# EAGLE design Adafruit DC+Stepper Wing (EAGLE 6.4)
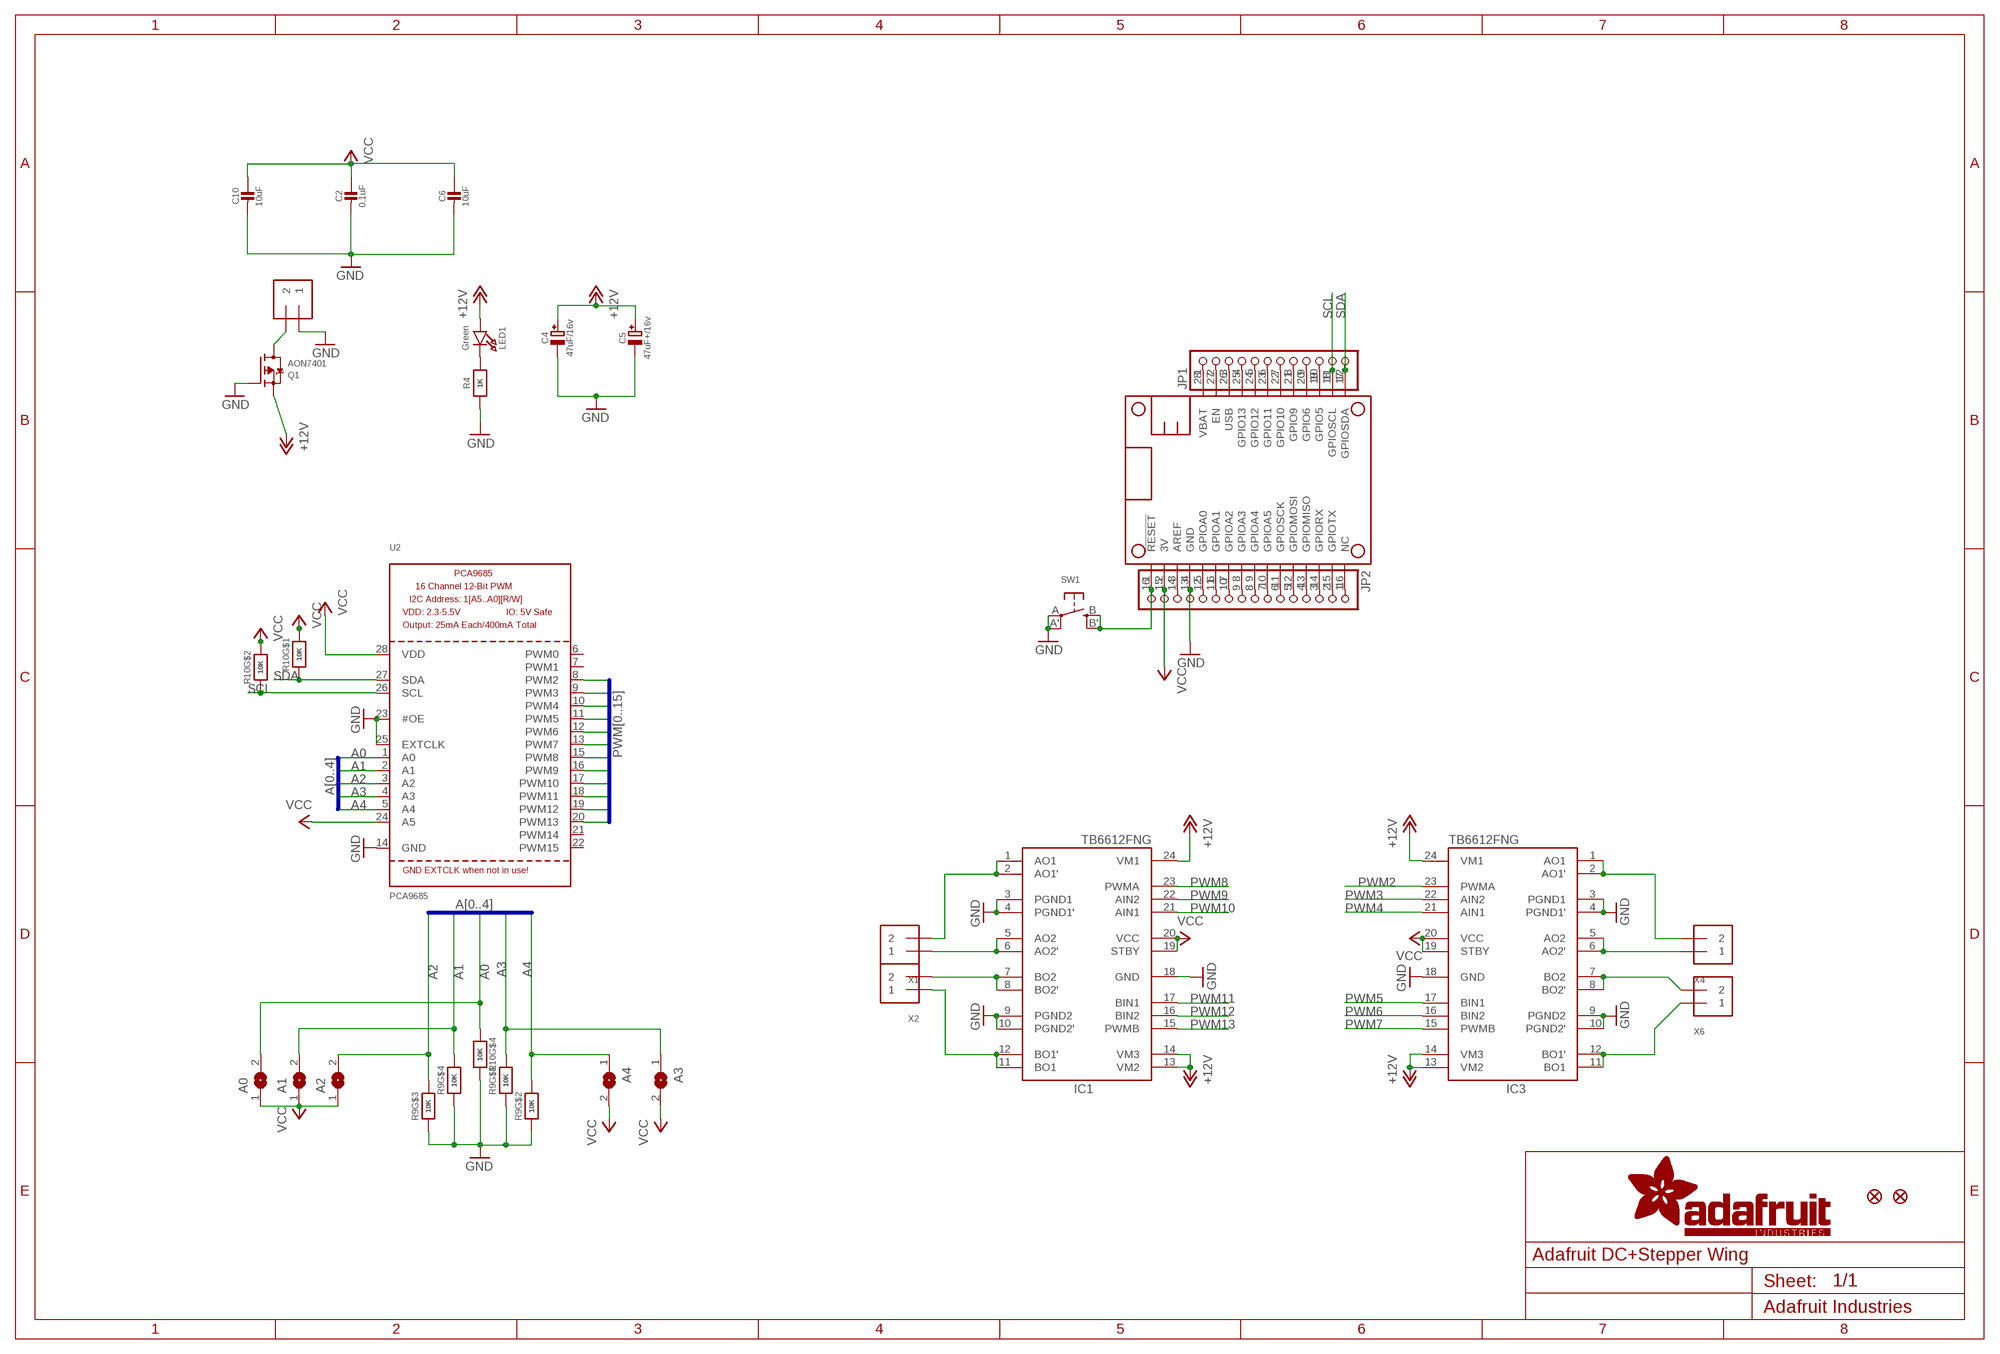
[diagram p0: schematic, sheet 1]

## Parts
A0  SOLDERJUMPERREFLOW_NOPASTE  [SOLDERJUMPER_REFLOW_NOPASTE]
A1  SOLDERJUMPERREFLOW_NOPASTE  [SOLDERJUMPER_REFLOW_NOPASTE]
A2  SOLDERJUMPERREFLOW_NOPASTE  [SOLDERJUMPER_REFLOW_NOPASTE]
A3  SOLDERJUMPERREFLOW_NOPASTE  [SOLDERJUMPER_REFLOW_NOPASTE]
A4  SOLDERJUMPERREFLOW_NOPASTE  [SOLDERJUMPER_REFLOW_NOPASTE]
C2  0.1uF  CAP_CERAMIC0805-NOOUTLINE  [0805-NO]
C4  47uF/16v  CAP_ELECTROLYTICPANASONIC_C  [PANASONIC_C]
C5  47uF+/16v  CAP_ELECTROLYTICPANASONIC_C  [PANASONIC_C]
C6  10uF  CAP_CERAMIC0805-NOOUTLINE  [0805-NO]
C10  10uF  CAP_CERAMIC0805-NOOUTLINE  [0805-NO]
IC1  TB6612FNG  [SSOP24]
IC3  TB6612FNG  [SSOP24]
JP1  HEADER-1X12  [1X12_ROUND]
JP2  HEADER-1X16ROUND  [1X16_ROUND]
LED1  Green  LED0805_NOOUTLINE  [CHIPLED_0805_NOOUTLINE]
MPOWER  1X2-3.5MM  [1X2-3.5MM]
MS1  FEATHERWING  [FEATHERWING]
Q1  AON7401  MOSFET-P-POWERDI3333  [POWERDI3333]
R4  1K  RESISTOR0805_NOOUTLINE  [0805-NO]
R9  10K  RESISTOR_4PACK  [RESPACK_4X0603]
R10  10K  RESISTOR_4PACK  [RESPACK_4X0603]
SW1  SWITCH_TACT_SMT4.6X2.8  [BTN_KMR2_4.6X2.8]
U2  PCA9685  [TSSOP28]
U$3  FIDUCIAL""  [FIDUCIAL_1MM]
U$4  FIDUCIAL""  [FIDUCIAL_1MM]
X1  TERMBLOCK_1X2  [TERMBLOCK_1X2-3.5MM]
X2  TERMBLOCK_1X2  [TERMBLOCK_1X2-3.5MM]
X4  TERMBLOCK_1X2  [TERMBLOCK_1X2-3.5MM]
X6  TERMBLOCK_1X2  [TERMBLOCK_1X2-3.5MM]

## Nets
+12V: C4.+ C5.+ IC1.13(VM2) IC1.14(VM3) IC1.24(VM1) IC3.13(VM2) IC3.14(VM3) IC3.24(VM1) LED1.A Q1.1(S) Q1.2(S) Q1.3(S)
A0: A0.2 R10.4 U2.1(A0)
A1: A1.2 R9.5 U2.2(A1)
A2: A2.2 R9.6 U2.3(A2)
A3: A3.1 R9.8 U2.4(A3)
A4: A4.1 R9.7 U2.5(A4)
GND: C2.2 C4.- C5.- C6.2 C10.2 IC1.3(PGND1) IC1.4(PGND1') IC1.9(PGND2) IC1.10(PGND2') IC1.18(GND) IC3.3(PGND1) IC3.4(PGND1') IC3.9(PGND2) IC3.10(PGND2') IC3.18(GND) JP2.13 MPOWER.1 MS1.4(GND) Q1.4(G) R4.1 R9.1 R9.2 R9.3 R9.4 R10.5 SW1.A'(P1) SW1.A(P) U2.14(GND) U2.23(#OE) U2.25(EXTCLK)
N$1: JP1.2 MS1.27(EN)
N$2: JP1.4 MS1.25(GPIO13)
N$3: MPOWER.2 Q1.5678(D)
N$4: IC1.1(AO1) IC1.2(AO1') X1.2
N$5: JP1.5 MS1.24(GPIO12)
N$6: IC1.5(AO2) IC1.6(AO2') X1.1
N$7: IC1.7(BO2) IC1.8(BO2') X2.2
N$8: JP1.6 MS1.23(GPIO11)
N$9: IC1.11(BO1) IC1.12(BO1') X2.1
N$10: JP1.7 MS1.22(GPIO10)
N$11: JP1.8 MS1.21(GPIO9)
N$12: IC3.1(AO1) IC3.2(AO1') X4.2
N$13: JP1.9 MS1.20(GPIO6)
N$14: IC3.5(AO2) IC3.6(AO2') X4.1
N$15: IC3.7(BO2) IC3.8(BO2') X6.2
N$16: JP1.10 MS1.19(GPIO5)
N$17: IC3.11(BO1) IC3.12(BO1') X6.1
N$18: JP2.1 MS1.16(NC)
N$19: JP2.2 MS1.15(GPIOTX)
N$20: JP2.3 MS1.14(GPIORX)
N$21: JP2.4 MS1.13(GPIOMISO)
N$22: JP2.5 MS1.12(GPIOMOSI)
N$23: JP2.6 MS1.11(GPIOSCK)
N$24: JP2.7 MS1.10(GPIOA5)
N$25: JP2.8 MS1.9(GPIOA4)
N$26: JP2.9 MS1.8(GPIOA3)
N$27: JP2.10 MS1.7(GPIOA2)
N$28: JP2.11 MS1.6(GPIOA1)
N$29: JP2.12 MS1.5(GPIOA0)
N$30: JP2.14 MS1.3(AREF)
N$32: JP2.16 MS1.1(!RESET) SW1.B'(S1) SW1.B(S)
N$133: LED1.C R4.2
PWM2: IC3.23(PWMA) U2.8(PWM2)
PWM3: IC3.22(AIN2) U2.9(PWM3)
PWM4: IC3.21(AIN1) U2.10(PWM4)
PWM5: IC3.17(BIN1) U2.11(PWM5)
PWM6: IC3.16(BIN2) U2.12(PWM6)
PWM7: IC3.15(PWMB) U2.13(PWM7)
PWM8: IC1.23(PWMA) U2.15(PWM8)
PWM9: IC1.22(AIN2) U2.16(PWM9)
PWM10: IC1.21(AIN1) U2.17(PWM10)
PWM11: IC1.17(BIN1) U2.18(PWM11)
PWM12: IC1.16(BIN2) U2.19(PWM12)
PWM13: IC1.15(PWMB) U2.20(PWM13)
SCL: JP1.11 MS1.18(GPIOSCL) R10.2 U2.26(SCL)
SDA: JP1.12 MS1.17(GPIOSDA) R10.1 U2.27(SDA)
USB: JP1.3 MS1.26(USB)
VBAT: JP1.1 MS1.28(VBAT)
VCC: A0.1 A1.1 A2.1 A3.2 A4.2 C2.1 C6.1 C10.1 IC1.19(STBY) IC1.20(VCC) IC3.19(STBY) IC3.20(VCC) JP2.15 MS1.2(3V) R10.7 R10.8 U2.24(A5) U2.28(VDD)
Unconnected: R10.3 R10.6 U2.6(PWM0) U2.7(PWM1) U2.21(PWM14) U2.22(PWM15)

## Buses
PWM[0..15]
A[0..4]

## Library data of the parts
A0 A1-A4 = microbuilder:SOLDERJUMPER: SMD Solder JUMPER Solder the two pads together to create a connection, or remove the solder to break it. REFLOW - Use this footprint for solder paste and reflow ovens. WAVE - Use this footprint for hand-soldering (larger pads). CLOSED - Has a trace between the two pads to ensure it is closed by default. The trace needs to be cut to disable the jumper, and can be closed again by creating a solder bridge between the two pads.
C2 C6 C10 = microbuilder:CAP_CERAMIC: Ceramic Capacitors For new designs, use the packages preceded by an '_' character since they are more reliable: The following footprints should be used on most boards: _0402 - Standard footprint for regular board layouts _0603 - Standard footprint for regular board layouts _0805 - Standard footprint for regular board layouts _1206 - Standard footprint for regular board layouts For extremely tight-pitch boards where space is at a premium, the following 'micro-pitch' footprints can be used (smaller pads, no silkscreen outline, etc.): _0402MP - Micro-pitch footprint for very dense/compact boards _0603MP - Micro-pitch footprint for very dense/compact boards _0805MP - Micro-pitch footprint for very dense/compact boards _1206MP - Micro-pitch footprint for very dense/compact boards
C4 C5 = microbuilder:CAP_ELECTROLYTIC: Electrolytic Capacitors SMT PANASONIC_C - Size C Panasonic Electrolytic Aluminum Capacitor 47µF 16V 20% Electrolytic Capacitor [Digikey: PCE3890TR-ND] PANASONIC_D - Size D Panasonic Electrolytic Aluminum Capacitor 100µF 25V 20% Electrolytic Capacitor [Digikey: PCE3898TR-ND] PTH 3.5 mm grid, 8 mm diameter ... 3.5 mm grid, 10 mm diameter ...
IC1 IC3 = adafruit:TB6612FNG: TB6612FNG MOS dual H-bridge motor driver, 1.2A current 3.2A peak 3 or 5v logic and 3-15v motor
JP1 = microbuilder:HEADER-1X12
JP2 = microbuilder:HEADER-1X16: PIN HEADER
LED1 = microbuilder:LED: LED 0603 - 0603 Surface Mount Package 2mA: Green LED - Low Power (3.9mcd, 2ma, 1.7Vf) - Digikey: 475-2709-2-ND Orange LED - Low Power (9.8mcd, 2ma, 1.8Vf) - Digikey: 475-1194-2-ND Red LED - Low Power (5mcd, 2ma, 1.8Vf) - Digikey: 475-1195-2-ND Yellow LED - Low Power (7mcd, 2ma, 1.8Vf) - Digikey: 475-1196-2-ND 5mA: Blue LED - Low Power (17mcd, 5ma, 2.9Vf) - Digikey: LNJ937W8CRACT-ND 0805 - 0805 Surface Mount Package 2mA: Red LED (8.8mcd, 2mA, 1.8Vf, Clear) - Low Power [Digikey: 475-2510-1-ND] Green LED (5mcd, 2mA, 1.8Vf, Clear) - Low Power [Digikey: 475-2730-1-ND] Yellow LED (11.3mcd, 2mA, 1.8Vf, Clear) - Low Power [Digikey: 475-2555-1-ND] 20mA: Red LED (104mcd, 20mA, Diffused) - LS R976 [Digikey: 475-1278-6-ND] Red LED (12mcd, 20mA, 2.0Vf, Clear) - APT2012EC [Digikey: 754-1128-1-ND] Green LED (15mcd, 20mA, 2.2Vf, Clear) - APT2012GC [Digikey: 754-1131-1-ND] Orange LED (160mcd, 20mA, 2.1Vf, Clear) - APT2012SECK [Digikey: 754-1130-1-ND] 1206 - 1206 Surface Mount Package Green LED (26mcd, 20mA, Diffused) - LG N971 [Digikey: 475-1407-6-ND] Red LED (15mcd, 20mA, Diffused) - LH N974 [Digikey: 475-1416-6-ND] Cree - Cree High-Power Surface Mount LEDs XPEBWT-L1-0000-00D50 - White 111lm 350mA 2.9Vf 6200K 110° XTEAWT-00-0000-00000LEE3 - White 114lm 350mA 2.85Vf 5000K 115° Everlight - Everlight 45-21 Series Surface Mount LEDs 45-21/QK2C-B2832AC2CB2/2T - Warm White 2000mcd 20mA 3.25Vf 3050K 120° 45-21/LK2C-B38452C4CB2/2T - Nuetral White 2000mcd 20mA 3.25Vf 4150K 120° 45-21/LK2C-B50634C6CB2/2T - Cold White 2200mcd 20mA 3.25Vf 5650K 120° PLCC2 Reverse Mount LS T77K-J1L2-1-0-2-R18-Z - Red 11.25mcd 2mA 1.8Vf 630nm 120° LO T77K-L1M2-24-Z - Orange 19.6mcd 2mA 1.8Vf 606nm 120° LY T77K-K2M1-26-Z - Yellow 15.7mcd 2mA 1.8Vf 587nm 120°
MPOWER = adafruit:1X2: 3.5mm Terminal block http://www.ladyada.net/library/pcb/eaglelibrary.html
MS1 = microbuilder:FEATHERWING
Q1 = microbuilder:MOSFET-P: P-Channel Mosfet LEGEND VDS: Voltage Drain-Source ID: Drain Current RDS(ON): Drain-Source On-State Resistance VGS(TH): Gate-Source Threshold Voltage CISS: Drain-Source Input Capacitance SOT-23 Name VDS ID RDS(ON) VGS(TH) CISS Order Number IRLML5103 30V 760mA 600 mOhm -- 75pF @ 25V Digikey: IRLML5103PBFCT-ND IRLML6401 12V 4.3A 50 mOhm 950mV @ 250µA 830pF @ 10V Digikey: IRLML6401PBFTR-ND NTR0202PL 20V 400mA 800 mOhm 2.3V @ 250uA 70pF @ 5V Digikey: NTR0202PLT1GOSTR-ND NTR4101PT1G 20V 1.8A 85 mOhm 1.2V @ 250uA 675pF @ 10V Digikey: NTR4101PT1GOSCT-ND DMP2004K 20V 600mA 900 mOhm 1V @ 250uA 175pF @ 16V Digikey: DMP2004KDICT-ND PMV65XP 20V 3.9A 76 mOhm 950mV @ 1mA 725pF @ 20V Digikey: 568-2358-2-ND TO-252 Name VDS ID RDS(ON) VGS(TH) CISS Order Number AOD417 30V 25A 34 mOhm 3V @ 250µA 920pF @ 15V Digikey: 785-1106-2-ND
R4 = microbuilder:RESISTOR: Resistors For new designs, use the packages preceded by an '_' character since they are more reliable: The following footprints should be used on most boards: _0402 - Standard footprint for regular board layouts _0603 - Standard footprint for regular board layouts _0805 - Standard footprint for regular board layouts _1206 - Standard footprint for regular board layouts For extremely tight-pitch boards where space is at a premium, the following 'micro-pitch' footprints can be used (smaller pads, no silkscreen outline, etc.): _0402MP - Micro-pitch footprint for very dense/compact boards _0603MP - Micro-pitch footprint for very dense/compact boards _0805MP - Micro-pitch footprint for very dense/compact boards _1206MP - Micro-pitch footprint for very dense/compact boards
R9 R10 = microbuilder:RESISTOR_4PACK: Resistor Packs (4 resistors) 4 x 0603 10K 1/16W - Digikey: YC164J-10KCT-ND
SW1 = microbuilder:SWITCH_TACT_SMT: SMT Tact Switches 6x6mm - Digikey: P12940SCT-ND KMR2 (4.6x2.8mm) - Digikey: 401-1426-1-ND EVQ-PQHB55 - Light Touch, 160GF (4.5x4.5mm) - Digikey: P8090SCT-ND KMT0 - KMT021 NGJ LHS (etc.) IP68/Waterproof - Digikey: CKN10289CT-ND
U2 = microbuilder:PCA9685: PCA9685 - 16 Channel 12-Bit I2C PWM Controller 5.0V tolerant 16 channel, 12-bit I2C PWM controller with 25mA per output (max. 400mA total) Digikey: 568-5931-1-ND
U$3 U$4 = microbuilder:FIDUCIAL: Fiducial Alignment Points Various fiducial points for machine vision alignment.; BOM: EXCLUDE
X1 X2 X4 X6 = microbuilder:TERMBLOCK_1X2: 3.5mm Terminal block http://www.ladyada.net/library/pcb/eaglelibrary.html

## Board
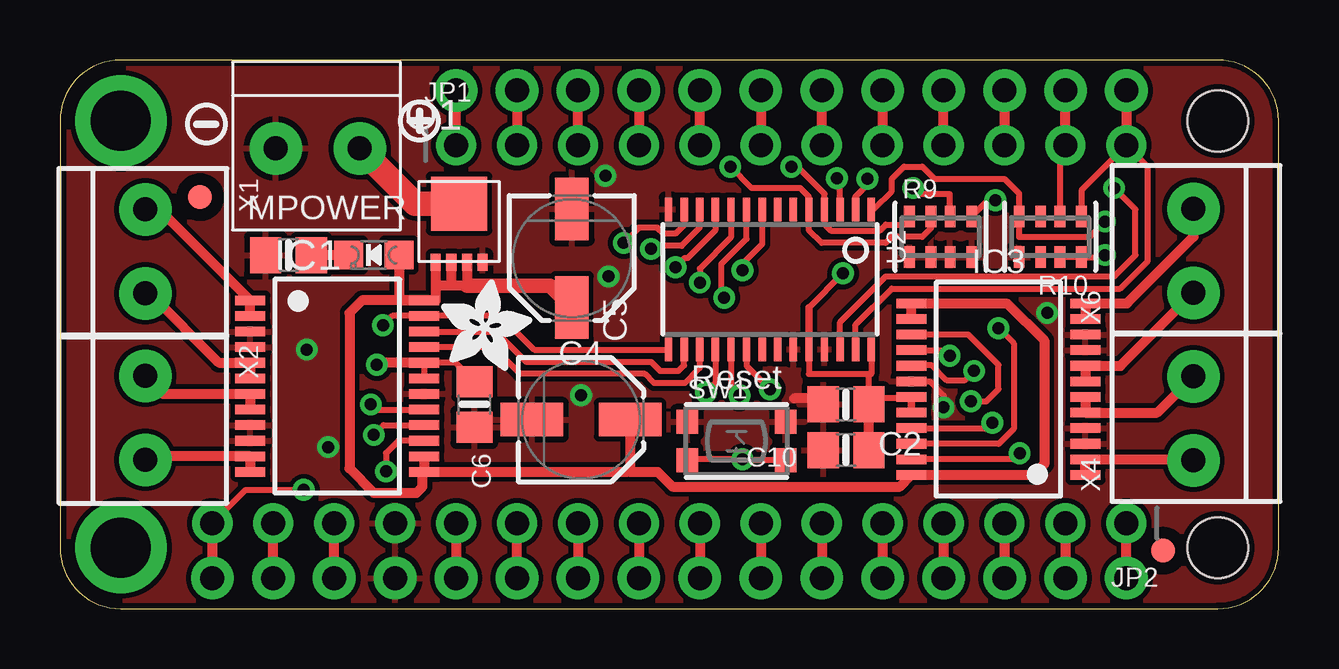
[diagram p1: board, top side]
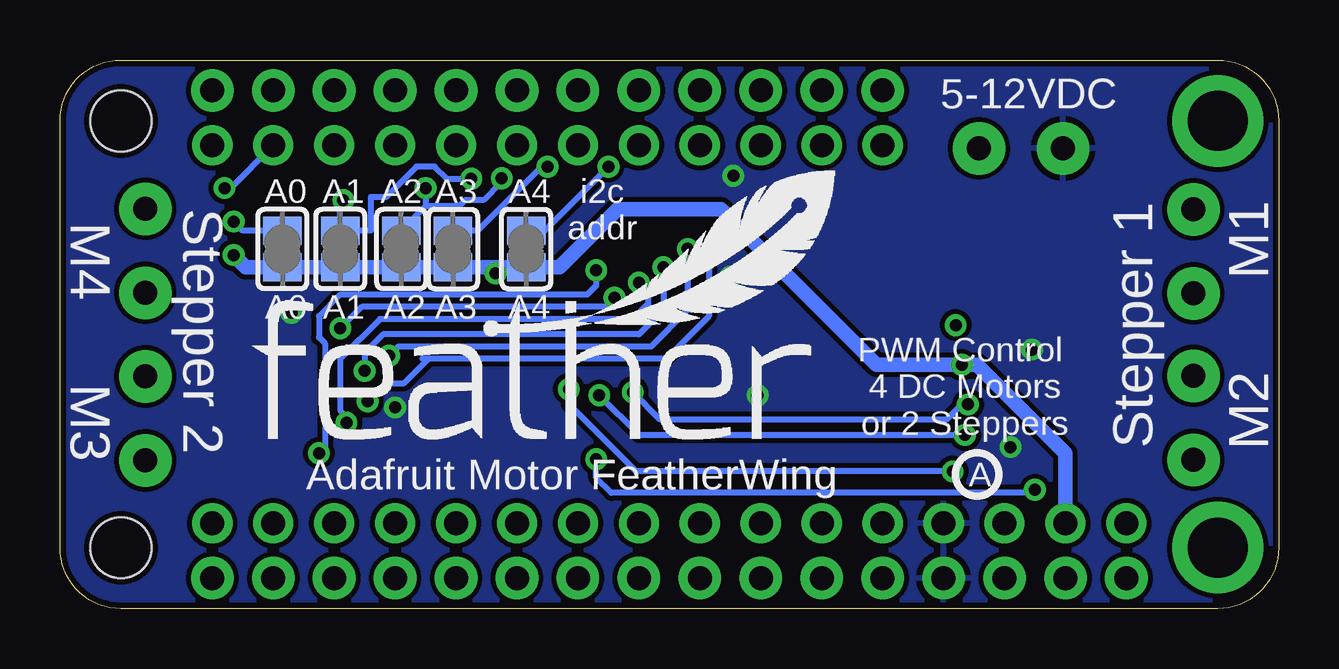
[diagram p2: board, bottom side, seen from below]

Size 50.8 x 22.86 mm. Coordinates in mm from the lower left corner, seen from the top.
Copper layers (1*16): Top 0.035mm / dielectric 1.5mm / Bottom 0.035mm
Design rules "adafruit *": minimum track width 8mil, minimum drill 15.5mil, track to track 8mil, track to pad 8mil, pad to pad 8mil, via to via 8mil, smd to smd 8mil, copper to edge 10mil, drill to drill 8mil, minimum pad ring 10mil, minimum via ring 8mil, stop-mask expansion 2mil, vias tented up to drill 20mil, thermal gap 10mil

### Footprints (pad centres in the part's own frame; a part is rotated, then mirrored left to right if it is on the bottom)
SOLDERJUMPER_REFLOW_NOPASTE = smd 1.168 x 1.6: 1 -0.762,0; 2 0.762,0
0805-NO = smd 1.3 x 1.5: 1 -0.95,0; 2 0.95,0
PANASONIC_C = smd 2.6 x 1.4: + 2.05,0; - -2.05,0
SSOP24 = smd 0.4 x 1.25: 1 -3.575,-3.625; 2 -2.925,-3.625; 3 -2.275,-3.625; 4 -1.625,-3.625; 5 -0.975,-3.625; 6 -0.325,-3.625; 7 0.325,-3.625; 8 0.975,-3.625; 9 1.625,-3.625; 10 2.275,-3.625; 11 2.925,-3.625; 12 3.575,-3.625; 13 3.575,3.625; 14 2.925,3.625; 15 2.275,3.625; 16 1.625,3.625; 17 0.975,3.625; 18 0.325,3.625; 19 -0.325,3.625; 20 -0.975,3.625; 21 -1.625,3.625; 22 -2.275,3.625; 23 -2.925,3.625; 24 -3.575,3.625
1X12_ROUND = drill 1 pad 1.676: 1 -13.97,0; 2 -11.43,0; 3 -8.89,0; 4 -6.35,0; 5 -3.81,0; 6 -1.27,0; 7 1.27,0; 8 3.81,0; 9 6.35,0; 10 8.89,0; 11 11.43,0; 12 13.97,0
1X16_ROUND = drill 1 pad 1.676: 1 -19.05,0; 2 -16.51,0; 3 -13.97,0; 4 -11.43,0; 5 -8.89,0; 6 -6.35,0; 7 -3.81,0; 8 -1.27,0; 9 1.27,0; 10 3.81,0; 11 6.35,0; 12 8.89,0; 13 11.43,0; 14 13.97,0; 15 16.51,0; 16 19.05,0
CHIPLED_0805_NOOUTLINE = smd 1.2 x 1.2: A 0,-1.05; C 0,1.05
1X2-3.5MM = drill 1 pad 2.184: 1 1.8,0; 2 -1.7,0
FEATHERWING = drill 1 pad 1.778: 1 6.35,1.27; 2 8.89,1.27; 3 11.43,1.27; 4 13.97,1.27; 5 16.51,1.27; 6 19.05,1.27; 7 21.59,1.27; 8 24.13,1.27; 9 26.67,1.27; 10 29.21,1.27; 11 31.75,1.27; 12 34.29,1.27; 13 36.83,1.27; 14 39.37,1.27; 15 41.91,1.27; 16 44.45,1.27; 17 44.45,21.59; 18 41.91,21.59; 19 39.37,21.59; 20 36.83,21.59; 21 34.29,21.59; 22 31.75,21.59; 23 29.21,21.59; 24 26.67,21.59; 25 24.13,21.59; 26 21.59,21.59; 27 19.05,21.59; 28 16.51,21.59 | drill 2.5 pad 3.81: P$1 2.54,20.32; P$2 2.54,2.54 | hole 2.54: 48.26,20.32; 48.26,2.54
POWERDI3333 = smd 0.7 x 0.42: 1 -1.7,0.975; 2 -1.7,0.325; 3 -1.7,-0.325; 4 -1.7,-0.975 | smd 2.25 x 2.35: 5678 0.75,0
RESPACK_4X0603 = smd 0.45 x 0.9: 1 -1.3,-0.85; 2 -0.4,-0.85; 3 0.4,-0.85; 4 1.3,-0.85; 5 1.3,0.85; 6 0.4,0.85; 7 -0.4,0.85; 8 -1.3,0.85
BTN_KMR2_4.6X2.8 = smd 0.9 x 1: A 2.05,0.8; A' -2.05,0.8; B 2.05,-0.8; B' -2.05,-0.8
TSSOP28 = smd 0.305 x 0.991: 1 -4.225,-2.918; 2 -3.575,-2.918; 3 -2.925,-2.918; 4 -2.275,-2.918; 5 -1.625,-2.918; 6 -0.975,-2.918; 7 -0.325,-2.918; 8 0.325,-2.918; 9 0.975,-2.918; 10 1.625,-2.918; 11 2.275,-2.918; 12 2.925,-2.918; 13 3.575,-2.918; 14 4.225,-2.918; 15 4.225,2.918; 16 3.575,2.918; 17 2.925,2.918; 18 2.275,2.918; 19 1.625,2.918; 20 0.975,2.918; 21 0.325,2.918; 22 -0.325,2.918; 23 -0.975,2.918; 24 -1.625,2.918; 25 -2.275,2.918; 26 -2.925,2.918; 27 -3.575,2.918; 28 -4.225,2.918
FIDUCIAL_1MM = smd 1 x 1: 1 0,0
TERMBLOCK_1X2-3.5MM = drill 1 pad 2.184: 1 1.8,0; 2 -1.7,0

### Placement (x,y rotation side)
A0  41.53,14.99 90 bottom
A1  39.12,14.99 90 bottom
A2  36.58,14.99 90 bottom
A3  34.42,14.99 270 bottom
A4  31.37,14.99 270 bottom
C2  32.77,8.51 180 top
C4  21.72,7.87 0 top
C5  21.34,14.61 270 top
C6  17.27,8.51 270 top
C10  32.77,6.6 180 top
IC1  11.56,9.27 270 top
IC3  39.12,9.14 90 top
JP1  30.48,19.3 0 top
JP2  25.4,3.56 180 top
LED1  13.08,14.73 90 top
MPOWER  10.79,19.18 180 top
MS1  0,0 0 top
Q1  16.64,16.13 90 top
R4  9.53,14.73 0 top
R9  36.7,15.49 0 top
R10  41.27,15.49 180 top
SW1  28.19,6.99 0 top
U2  29.59,13.72 180 top
U$1  [SYMBOL_PLUS]  14.99,20.32 0 top
U$2  [SYMBOL_MINUS]  6.1,20.19 0 top
U$3  5.84,17.14 0 top
U$4  45.97,2.41 0 top
U$5  [ADAFRUIT_3.5MM]  15.88,9.91 0 top
U$6  [FEATHERLOGO]  42.8,6.99 0 bottom
U$8  [PCBFEAT-REV-040]  12.57,5.59 0 bottom
X1  3.56,14.94 270 top
X2  3.56,8 270 top
X4  47.24,7.87 90 top
X6  47.24,14.86 90 top

### Tracks (layer width: path | path; a pad name or v marks a point on that pad's centre or on a via)
+12V
  Top 0.406: LED1.A 14.13,12.85 IC1.24 | IC1.14 IC1.13 | IC1.13 23.62,5.7 23.77,5.7 | 23.77,5.7 24.91,5.7 25.53,5.08 35,5.08 IC3.24 40.58,5.57 41.02,6.01 41.02,11.18 39.5,12.7 35.51,12.7 IC3.13 IC3.14 | IC1.24 12.59,12.85 12.06,12.32 12.06,5.84 13.08,4.83 14.86,4.83 15.11,5.08 15.11,5.63 IC1.13 | Q1.1 15.66,13.46 | 15.66,13.46 15.66,12.85 IC1.24 | Q1.2 16.31,13.46 | 16.31,13.46 15.66,13.46 | Q1.3 16.96,13.46 16.31,13.46 | C4.+ 23.77,5.7
  Top 0.61: C5.+ 20.43,13.46 16.96,13.46
A0  (via drill 0.5)
  Top 0.254: v43.56,16.13 42.93,15.49 39.98,15.49 R10.4 39.98,17.3 39.37,17.91 36.45,17.91 35.94,18.41 35.18,18.41 34.67,17.91 34.67,17.4 33.91,16.63 U2.1
  Bottom 0.254: A0.2 43.18,15.75 v43.56,16.13
A1  (via drill 0.5)
  Top 0.254: U2.2 33.17,17.16 | 33.17,17.16 33.66,17.65 v33.66,17.91 | 33.17,17.16 33.15,17.14 33.15,17.02 | R9.5 38.68,17.02 v38.99,17.02
  Bottom 0.254: v33.66,17.91 34.67,17.91 35.18,18.41 35.94,18.41 37.21,17.14 37.85,17.14 37.85,15.75 A1.2 39.12,16.89 v38.99,17.02
A2  (via drill 0.5)
  Top 0.254: R9.6 37.08,16.36 37.08,17.27 35.81,17.27 v35.56,17.53 | U2.3 32.52,17.8 v32.38,17.93
  Bottom 0.254: 35.56,16.76 34.16,16.76 33.91,17.02 33.15,17.02 32.38,17.78 v32.38,17.93 | 35.56,16.76 A2.2 | v35.56,17.53 35.56,16.76
A3  (via drill 0.5)
  Top 0.254: R9.8 35.06,16 34.43,16 34.17,15.75 32.13,15.75 31.87,16.01 U2.4 31.87,17.28 30.73,18.41 v30.48,18.41
  Bottom 0.254: A3.1 33.4,15.75 30.73,18.41 v30.48,18.41
A4  (via drill 0.5)
  Top 0.254: R9.7 36.3,15.86 35.94,15.49 34.67,15.49 34.42,15.24 31.75,15.24 31.22,15.77 U2.5 31.22,17.17 30.86,17.53 28.83,17.53 v27.94,18.41
  Bottom 0.254: A4.1 30.61,15.75 v27.94,18.41
GND  (via drill 0.5)
  Top 0.254: IC3.18 36.25,9.47 36.83,8.89 v36.83,8.38
  Top 0.406: C2.2 31.56,8.76 30.61,8.76
  other vias: 21.72,8.89 10.29,10.79 22.73,18.03 11.18,6.73 22.86,13.84 41.15,12.32
  pour Bottom: 0,22.86 0,0 50.8,0 50.8,22.86
  pour Top: 0,22.86 0,0 50.8,0 50.8,22.86
N$1
  Top 0.406: MS1.27 JP1.2
N$2
  Top 0.406: MS1.25 JP1.4
N$3
  Top 1.016: MPOWER.2 14.79,16.88 Q1.5678
N$4
  Top 0.406: IC1.2 IC1.1 4.09,16.69 3.61,16.69 X1.2
N$5
  Top 0.406: JP1.5 MS1.24
N$6
  Top 0.406: IC1.6 IC1.5 6.62,10.25 3.73,13.13 X1.1
N$7
  Top 0.406: IC1.8 IC1.7 4.31,8.95 X2.2
N$8
  Top 0.406: MS1.23 JP1.6
N$9
  Top 0.406: IC1.12 IC1.11 3.7,6.35 X2.1
N$10
  Top 0.406: JP1.7 MS1.22
N$11
  Top 0.406: MS1.21 JP1.8
N$12
  Top 0.406: IC3.1 IC3.2 47.2,6.22 X4.2
N$13
  Top 0.406: JP1.9 MS1.20
N$14
  Top 0.406: IC3.6 IC3.5 45.74,8.17 X4.1
N$15
  Top 0.406: IC3.7 IC3.8 44.2,10.12 X6.2
N$16
  Top 0.406: MS1.19 JP1.10
N$17
  Top 0.406: IC3.11 IC3.12 44.47,12.72 47.24,15.49 X6.1 47.12,16.79
N$18
  Top 0.406: MS1.16 JP2.1
N$19
  Top 0.406: JP2.2 MS1.15
N$20
  Top 0.406: JP2.3 MS1.14
N$21
  Top 0.406: JP2.4 MS1.13
N$22
  Top 0.406: JP2.5 MS1.12
N$23
  Top 0.406: JP2.6 MS1.11
N$24
  Top 0.406: JP2.7 MS1.10
N$25
  Top 0.406: JP2.8 MS1.9
N$26
  Top 0.406: JP2.9 MS1.8
N$27
  Top 0.406: JP2.10 MS1.7
N$28
  Top 0.406: MS1.6 JP2.11
N$29
  Top 0.406: JP2.12 MS1.5
N$30
  Top 0.406: MS1.3 JP2.14
N$32  (via drill 0.5)
  Top 0.254: JP2.16 7.75,4.95 v10.16,4.95 | SW1.B' 26.18,6.22 v28.45,6.22 28.49,6.18 SW1.B
  Top 0.406: JP2.16 MS1.1
  Bottom 0.254: v10.16,4.95 10.29,4.83 27.81,4.83 28.45,5.46 v28.45,6.22
N$133
  Top 0.406: LED1.C R4.2
PWM2  (via drill 0.5)
  Top 0.254: U2.8 29.27,15.18 28.45,14.37 v28.45,14.1 | 39.88,6.48 v40.01,6.48 39.75,6.22 IC3.23
  Bottom 0.254: v28.45,14.1 28.45,13.46 28.83,13.08 39.12,13.08 40.01,12.19 40.01,11.3 39.75,11.05 39.75,6.73 v40.01,6.48
PWM3  (via drill 0.5)
  Top 0.254: v27.69,12.95 27.56,13.08 27.56,14.35 28.62,15.41 U2.9 | v39.12,11.68 39.75,11.05 39.75,7.49 39.13,6.87 IC3.22
  Bottom 0.254: v27.69,12.95 27.69,12.57 38.23,12.57 v39.12,11.68
PWM4  (via drill 0.5)
  Top 0.254: U2.10 27.97,15.47 26.67,14.17 v26.67,13.59 | v38.86,7.75 38.61,7.49 35.52,7.49 IC3.21
  Bottom 0.254: v26.67,13.59 26.29,13.21 26.29,12.7 26.92,12.06 37.47,12.06 39.12,10.41 39.12,8.26 38.86,8 v38.86,7.75
PWM5  (via drill 0.5)
  Top 0.254: U2.11 27.32,15.76 26.16,14.61 26.04,14.61 v25.65,14.22 | IC3.17 35.53,10.16 36.32,10.16 36.96,9.53 37.72,9.53 v38.1,9.91
  Bottom 0.254: v25.65,14.22 25.65,12.45 26.67,11.43 37.34,11.43 38.1,10.67 v38.1,9.91
PWM6  (via drill 0.5)
  Top 0.254: U2.12 26.67,15.87 25.91,15.11 24.77,15.11 v24.64,14.99 | 35.52,10.79 IC3.16 36.86,10.77 v37.08,10.54
  Bottom 0.254: v24.64,14.99 24.64,12.45 26.16,10.92 36.7,10.92 v37.08,10.54
PWM7  (via drill 0.5)
  Top 0.254: U2.13 26.02,15.98 25.65,15.62 25.15,15.62 24.89,15.88 24.13,15.88 v23.5,15.24 | 35.5,11.43 IC3.15 37.86,11.42 39.12,10.16 39.12,9.14 38.61,8.64 v37.97,8.64
  Bottom 0.254: v23.5,15.24 23.75,14.99 23.75,12.19 25.53,10.41 35.43,10.41 | 35.43,10.41 35.69,10.41 | v37.97,8.64 37.21,9.4 36.45,9.4 35.43,10.41
PWM8  (via drill 0.5)
  Top 0.254: v13.46,11.81 13.85,12.2 IC1.23 18.36,12.2 19.76,10.79 U2.15
PWM9
  Top 0.254: IC1.22 18.17,11.55 19.43,10.29 24.64,10.29 25.02,9.91 25.78,9.91 26.02,10.14 U2.16
PWM10
  Top 0.254: U2.17 26.67,10.03 26.04,9.4 24.77,9.4 24.38,9.78 19.18,9.78 18.06,10.9 IC1.21
PWM11  (via drill 0.5)
  Top 0.254: v12.95,8.51 13.17,8.3 IC1.17 | U2.18 27.32,9.41 v26.92,9.02
  Bottom 0.254: v12.95,8.51 13.21,8.51 13.84,7.87 25.78,7.87 v26.92,9.02
PWM12  (via drill 0.5)
  Top 0.254: v13.08,7.24 13.49,7.65 IC1.16 | U2.19 27.97,9.24 v28.32,8.89
  Bottom 0.254: v13.08,7.24 26.67,7.24 v28.32,8.89
PWM13  (via drill 0.5)
  Top 0.254: IC1.15 14.11,7 13.59,6.48 v13.59,5.71 | U2.20 28.62,10.12 v29.59,9.14
  Bottom 0.254: v13.59,5.71 26.8,5.71 29.59,8.51 v29.59,9.14
SCL  (via drill 0.5)
  Top 0.254: U2.26 32.52,11.94 34.42,13.84 43.94,13.84 44.83,14.73 44.83,16.64 v43.94,17.53 | 41.66,16.32 R10.2 41.67,19.07 JP1.11
  Top 0.406: JP1.11 MS1.18
  Bottom 0.254: v43.94,17.53 43.69,17.53 JP1.11
SDA
  Top 0.254: R10.1 42.58,17.43 JP1.12 45.34,18.41 45.34,14.48 44.2,13.34 34.67,13.34 33.17,11.83 U2.27
  Top 0.406: MS1.17 JP1.12
USB
  Top 0.406: JP1.3 MS1.26
VBAT
  Top 0.406: JP1.1 MS1.28
VCC  (via drill 0.5)
  Top 0.254: IC1.19 IC1.20 16.48,10.25 C6.1 | R10.7 R10.8 43.47,14.64 v43.56,14.73 | U2.24 31.22,9.78 33.72,9.78 | 33.72,9.78 33.82,9.78 U2.28 | 33.72,9.78 C2.1 33.97,8.76 35.44,8.76 | 31.22,12.55 v32.64,13.97
  Top 0.305: 35.44,8.76 IC3.19 IC3.20 | U2.24 31.22,12.55
  Top 0.406: C10.1 C2.1 | MS1.2 JP2.15 | IC1.20 13.29,10.25 v13.21,10.16
  Bottom 0.61: JP2.15 8.89,6.48 12.57,10.16 v13.21,10.16 16.76,10.16 23.24,16.64 27.56,16.64 29.97,14.22 A4.2 | A4.2 31.24,14.22 | A4.2 32.38,14.22 v32.64,13.97 | A4.2 A3.2 A2.1 A1.1 A0.1 43.05,14.22 v43.56,14.73

### Text on the board
tPlace: Reset
bPlace: 5-12VDC | i2c / addr | A4 | A3 | A2 | A1 | A0 | M1 | M4 | Stepper 1 | Stepper 2 | PWM Control / 4 DC Motors / or 2 Steppers | M2 | M3 | Adafruit Motor FeatherWing